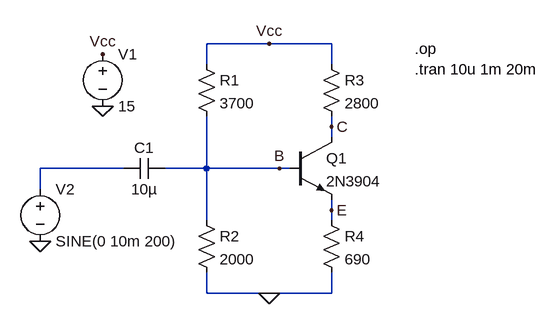
[diagram p0: schematic Draft2.asc]
Draft2.asc, the LTspice schematic file:
Version 4
SHEET 1 880 680
WIRE 176 80 80 80
WIRE 272 80 176 80
WIRE 80 112 80 80
WIRE 272 112 272 80
WIRE 272 208 272 192
WIRE 272 224 272 208
WIRE -48 272 -176 272
WIRE 80 272 80 192
WIRE 80 272 16 272
WIRE 192 272 80 272
WIRE 208 272 192 272
WIRE -176 304 -176 272
WIRE 272 336 272 320
WIRE 80 352 80 272
WIRE 272 352 272 336
WIRE 80 464 80 432
WIRE 176 464 80 464
WIRE 272 464 272 432
WIRE 272 464 176 464
FLAG -80 176 0
FLAG -80 96 Vcc
FLAG 176 80 Vcc
FLAG 176 464 0
FLAG 192 272 B
FLAG 272 336 E
FLAG 272 208 C
FLAG -176 384 0
SYMBOL voltage -80 80 R0
SYMATTR InstName V1
SYMATTR Value 15
SYMBOL Res 64 96 R0
SYMATTR InstName R1
SYMATTR Value 3700
SYMBOL Res 64 336 R0
SYMATTR InstName R2
SYMATTR Value 2000
SYMBOL Res 256 96 R0
SYMATTR InstName R3
SYMATTR Value 2800
SYMBOL Res 256 336 R0
SYMATTR InstName R4
SYMATTR Value 690
SYMBOL npn 208 224 R0
SYMATTR InstName Q1
SYMATTR Value 2N3904
SYMBOL Cap -48 288 R270
WINDOW 0 32 32 VTop 2
WINDOW 3 0 32 VBottom 2
SYMATTR InstName C1
SYMATTR Value 10µ
SYMBOL voltage -176 288 R0
SYMATTR InstName V2
SYMATTR Value SINE(0 10m 200)
TEXT 400 88 Left 2 !.op\n.tran 10u 1m 20m

The netlist it stands for:
* Draft2.asc
V1 Vcc 0 15
R1 Vcc B 3700
R2 B 0 2000
R3 Vcc C 2800
R4 E 0 690
Q1 C B E 0 2N3904
C1 N001 B 10µ
V2 N001 0 SINE(0 10m 200)
.model NPN NPN
.model PNP PNP
.lib standard.bjt
.op
.tran 10u 1m 20m
.backanno
.end